# Altium project AQ_PCB.PrjPcb
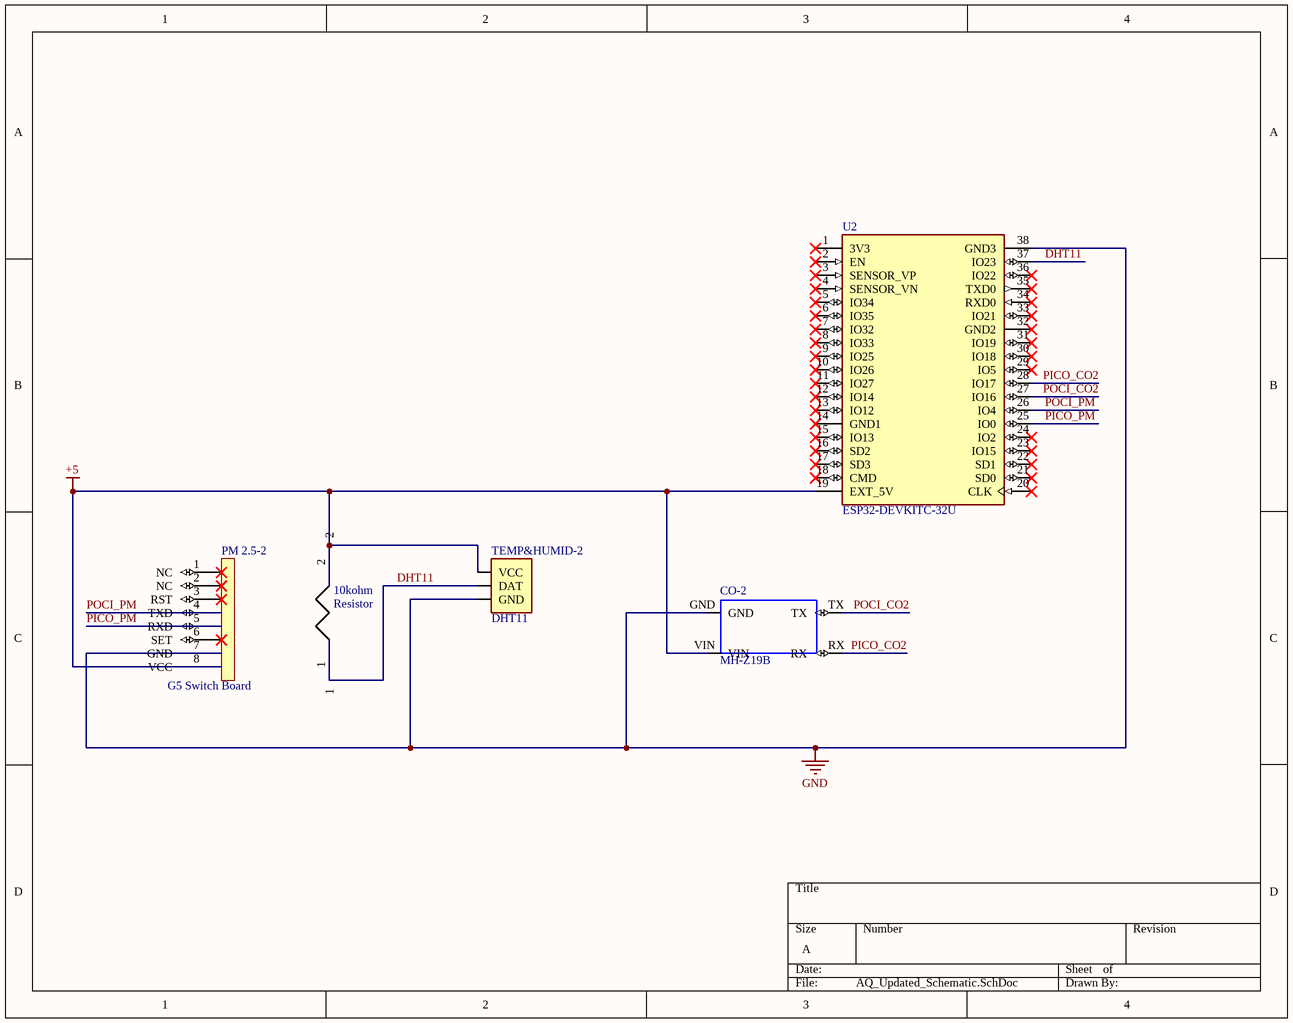
[diagram p0: AQ_Updated_Schematic.SchDoc]
1 sheet, 5 parts. Net scope: global (net labels, ports and power ports of the same name join across sheets).
Board file: AQ_PCB.PcbDoc

## Sheet AQ_Updated_Schematic.SchDoc
size A; SheetNumber: 1; SheetTotal: 1

### Parts
10kohm  Resistor  [Resistor]
CO-2  MH-Z19B  [MH-Z19B-FOOT]
PM_2.5-2  G5 Switch Board  [PM2.5]
TEMP&HUMID-2  DHT11  [SENSOR-DHT11]
U2  ESP32-DEVKITC-32U  [MODULE_ESP32-DEVKITC-32U]

### Nets
+5: 10kohm.2 CO-2.VIN PM_2.5-2.8(VCC) TEMP&HUMID-2.P$1(VCC) U2.19(EXT_5V)
GND: CO-2.GND PM_2.5-2.7(GND) TEMP&HUMID-2.P$4(GND) U2.38(GND3)
DHT11: 10kohm.1 TEMP&HUMID-2.P$2(DAT) U2.37(IO23)
PICO_CO2: CO-2.RX U2.28(IO17)
PICO_PM: PM_2.5-2.5(RXD) U2.25(IO0)
POCI_CO2: CO-2.TX U2.27(IO16)
POCI_PM: PM_2.5-2.4(TXD) U2.26(IO4)

Not connected (* = marked no-connect by the designer): PM_2.5-2 1(NC)* 2(NC)* 3(RST)* 6(SET)*; U2 1(3V3)* 2(EN)* 3(SENSOR_VP)* 4(SENSOR_VN)* 5(IO34)* 6(IO35)* 7(IO32)* 8(IO33)* 9(IO25)* 10(IO26)* 11(IO27)* 12(IO14)* 13(IO12)* 14(GND1)* 15(IO13)* 16(SD2)* 17(SD3)* 18(CMD)* 20(CLK)* 21(SD0)* 22(SD1)* 23(IO15)* 24(IO2)* 29(IO5)* 30(IO18)* 31(IO19)* 32(GND2)* 33(IO21)* 34(RXD0)* 35(TXD0)* 36(IO22)*

### Library data of the parts
CO-2 = MH-Z19B: Intelligent Infrared CO2 Module; MF: Winsen; MP: MH-Z19B; Availability: Not in stock; Check_prices: https://www.snapeda.com/parts/MH-Z19B/Winsen/view-part/?ref=eda; Package: Package; Value: *; SnapEDA_Link: https://www.snapeda.com/parts/MH-Z19B/Winsen/view-part/?ref=snap; Price: None
TEMP&HUMID-2 = DHT11: Humidity, Temperature Digital Â±5% RH Through Hole; MF: UNIVERSAL-SOLDER Electronics Ltd; SnapEDA_Link: https://www.snapeda.com/parts/DHT11/Ersa/view-part/?ref=snap; Package: None; Value: *; MP: DHT11; Check_prices: https://www.snapeda.com/parts/DHT11/Ersa/view-part/?ref=eda
U2 = ESP32-DEVKITC-32U: ESP32-WROOM-32UE series Transceiver; 802.11 b/g/n (Wi-Fi, WiFi, WLAN), Bluetooth® Smart Ready 4.x Dual Mode Evaluation Board; MF: Espressif Systems; SnapEDA_Link: https://www.snapeda.com/parts/ESP32-DEVKITC-32U/Espressif+Systems/view-part/?ref=snap; Package: CUSTOM-38 ESPRESSIF; Value: *; MP: ESP32-DEVKITC-32U; Check_prices: https://www.snapeda.com/parts/ESP32-DEVKITC-32U/Espressif+Systems/view-part/?ref=eda